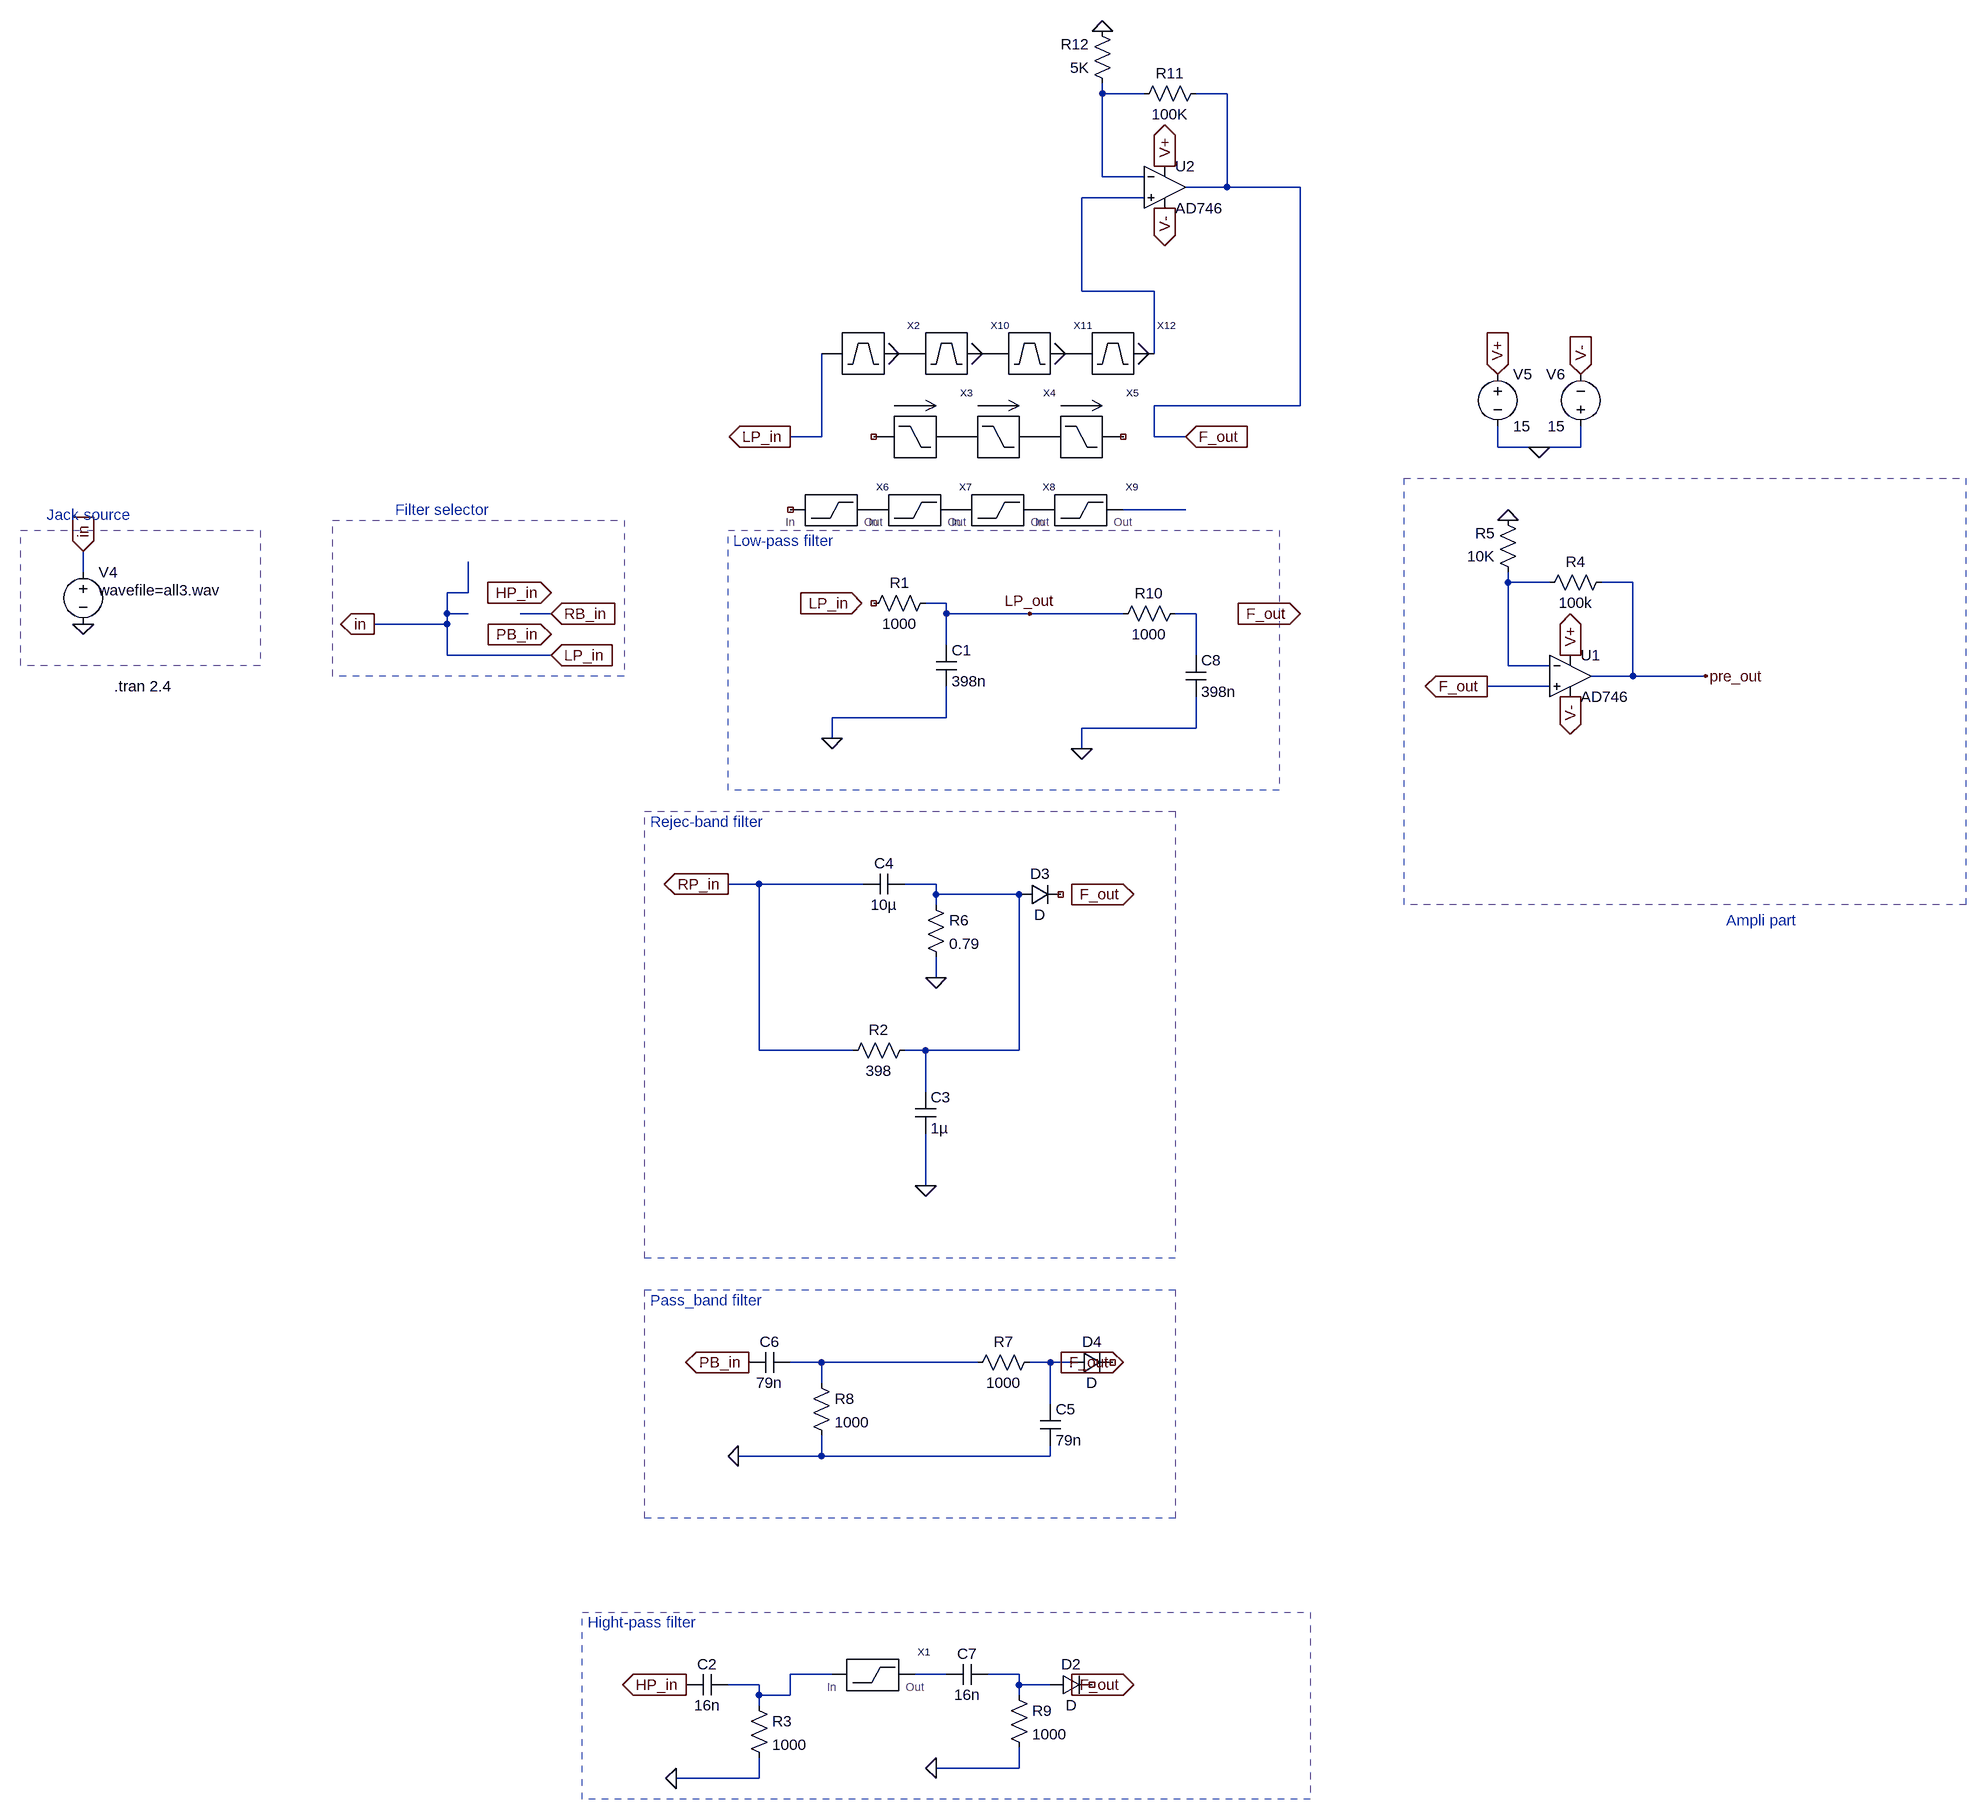
[diagram p0: schematic Filter_LT.asc]
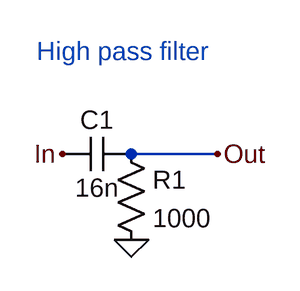
[diagram p1: sub-circuit hpassfilter.asc]
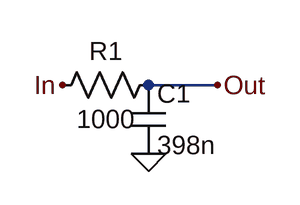
[diagram p2: sub-circuit lpassfilter.asc]
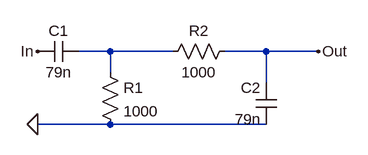
[diagram p3: sub-circuit bpassfilter.asc]
Filter_LT.asc, the LTspice schematic file:
Version 4
SHEET 1 2640 1908
WIRE 464 -720 464 -736
WIRE 528 -720 464 -720
WIRE 656 -720 608 -720
WIRE 464 -592 464 -720
WIRE 528 -592 464 -592
WIRE 656 -576 656 -720
WIRE 656 -576 592 -576
WIRE 768 -576 656 -576
WIRE 528 -560 432 -560
WIRE 432 -416 432 -560
WIRE 544 -416 432 -416
WIRE 544 -320 544 -416
WIRE 768 -240 768 -576
WIRE 768 -240 544 -240
WIRE 32 -192 32 -320
WIRE 32 -192 -16 -192
WIRE 544 -192 544 -240
WIRE 592 -192 544 -192
WIRE 1072 -176 1072 -208
WIRE 1136 -176 1072 -176
WIRE 1200 -176 1200 -208
WIRE 1200 -176 1136 -176
WIRE 592 -80 496 -80
WIRE -1104 16 -1104 -16
WIRE 1088 32 1088 16
WIRE 1152 32 1088 32
WIRE 1280 32 1232 32
WIRE -512 48 -512 0
WIRE -512 48 -544 48
WIRE 224 64 192 64
WIRE -544 80 -544 48
WIRE -512 80 -544 80
WIRE -384 80 -432 80
WIRE 224 80 224 64
WIRE 352 80 224 80
WIRE 496 80 352 80
WIRE 608 80 576 80
WIRE -544 96 -544 80
WIRE -544 96 -656 96
WIRE 224 128 224 80
WIRE -544 144 -544 96
WIRE -384 144 -544 144
WIRE 608 144 608 80
WIRE 1088 160 1088 32
WIRE 1152 160 1088 160
WIRE 1280 176 1280 32
WIRE 1280 176 1216 176
WIRE 1392 176 1280 176
WIRE 1152 192 1056 192
WIRE 224 240 224 192
WIRE 224 240 48 240
WIRE 608 256 608 208
WIRE 608 256 432 256
WIRE 48 272 48 240
WIRE 432 288 432 256
WIRE -64 496 -112 496
WIRE 96 496 -64 496
WIRE 208 496 160 496
WIRE 208 512 208 496
WIRE 336 512 208 512
WIRE 208 528 208 512
WIRE 208 640 208 608
WIRE -64 752 -64 496
WIRE 80 752 -64 752
WIRE 192 752 160 752
WIRE 336 752 336 512
WIRE 336 752 192 752
WIRE 192 816 192 752
WIRE 192 960 192 880
WIRE 32 1232 -16 1232
WIRE 272 1232 32 1232
WIRE 384 1232 352 1232
WIRE 416 1232 384 1232
WIRE 32 1264 32 1232
WIRE 384 1296 384 1232
WIRE 32 1376 32 1344
WIRE 32 1376 -96 1376
WIRE 384 1376 384 1360
WIRE 384 1376 32 1376
WIRE 48 1712 -16 1712
WIRE 224 1712 176 1712
WIRE 336 1712 288 1712
WIRE -64 1728 -112 1728
WIRE 336 1728 336 1712
WIRE 384 1728 336 1728
WIRE -64 1744 -64 1728
WIRE -16 1744 -16 1712
WIRE -16 1744 -64 1744
WIRE 336 1744 336 1728
WIRE -64 1760 -64 1744
WIRE 336 1856 336 1824
WIRE 336 1856 208 1856
WIRE -64 1872 -64 1840
WIRE -64 1872 -192 1872
FLAG 48 272 0
FLAG -1104 -16 in
IOPIN -1104 -16 In
FLAG 0 64 LP_in
IOPIN 0 64 Out
FLAG -1104 96 0
FLAG -176 1728 HP_in
IOPIN -176 1728 Out
FLAG -192 1872 0
FLAG 1184 144 V+
IOPIN 1184 144 Out
FLAG 1184 208 V-
IOPIN 1184 208 Out
FLAG 1072 -288 V+
IOPIN 1072 -288 In
FLAG 1200 -288 V-
IOPIN 1200 -288 In
FLAG 1136 -176 0
FLAG 512 1728 F_out
IOPIN 512 1728 In
FLAG 1088 -64 0
FLAG 1056 192 F_out
IOPIN 1056 192 Out
FLAG -656 96 in
IOPIN -656 96 Out
FLAG -384 48 HP_in
IOPIN -384 48 In
FLAG -384 144 LP_in
IOPIN -384 144 In
FLAG 192 960 0
FLAG -112 496 RP_in
IOPIN -112 496 Out
FLAG 208 640 0
FLAG 512 512 F_out
IOPIN 512 512 In
FLAG -384 80 RB_in
IOPIN -384 80 In
FLAG -384 112 PB_in
IOPIN -384 112 In
FLAG -80 1232 PB_in
IOPIN -80 1232 Out
FLAG -96 1376 0
FLAG 496 1232 F_out
IOPIN 496 1232 In
FLAG 352 80 LP_out
FLAG 768 80 F_out
IOPIN 768 80 In
FLAG 208 1856 0
FLAG 432 288 0
FLAG -16 -192 LP_in
IOPIN -16 -192 Out
FLAG 592 -192 F_out
IOPIN 592 -192 In
FLAG 1392 176 pre_out
FLAG 560 -608 V+
IOPIN 560 -608 Out
FLAG 560 -544 V-
IOPIN 560 -544 Out
FLAG 464 -816 0
SYMBOL cap 208 128 R0
SYMATTR InstName C1
SYMATTR Value 398n
SYMBOL res 208 48 R90
WINDOW 0 0 56 VBottom 2
WINDOW 3 32 56 VTop 2
SYMATTR InstName R1
SYMATTR Value 1000
SYMBOL voltage -1104 0 R0
WINDOW 3 24 44 Left 2
SYMATTR Value wavefile=all3.wav
SYMATTR InstName V4
SYMBOL cap -176 1744 R270
WINDOW 0 32 32 VTop 2
WINDOW 3 0 32 VBottom 2
SYMATTR InstName C2
SYMATTR Value 16n
SYMBOL res -80 1744 R0
SYMATTR InstName R3
SYMATTR Value 1000
SYMBOL OpAmps\\AD746 1184 112 R0
SYMATTR InstName U1
SYMBOL voltage 1072 -304 R0
WINDOW 123 0 0 Left 0
WINDOW 39 0 0 Left 0
SYMATTR InstName V5
SYMATTR Value 15
SYMBOL voltage 1200 -192 R180
WINDOW 0 24 96 Left 2
WINDOW 3 24 16 Left 2
WINDOW 123 0 0 Left 0
WINDOW 39 0 0 Left 0
SYMATTR InstName V6
SYMATTR Value 15
SYMBOL res 1248 16 R90
WINDOW 0 0 56 VBottom 2
WINDOW 3 32 56 VTop 2
SYMATTR InstName R4
SYMATTR Value 100k
SYMBOL res 1104 32 R180
WINDOW 0 36 76 Left 2
WINDOW 3 36 40 Left 2
SYMATTR InstName R5
SYMATTR Value 10K
SYMBOL cap 176 816 R0
SYMATTR InstName C3
SYMATTR Value 1µ
SYMBOL res 176 736 R90
WINDOW 0 0 56 VBottom 2
WINDOW 3 32 56 VTop 2
SYMATTR InstName R2
SYMATTR Value 398
SYMBOL cap 96 512 R270
WINDOW 0 32 32 VTop 2
WINDOW 3 0 32 VBottom 2
SYMATTR InstName C4
SYMATTR Value 10µ
SYMBOL res 192 512 R0
SYMATTR InstName R6
SYMATTR Value 0.79
SYMBOL cap 368 1296 R0
SYMATTR InstName C5
SYMATTR Value 79n
SYMBOL res 368 1216 R90
WINDOW 0 0 56 VBottom 2
WINDOW 3 32 56 VTop 2
SYMATTR InstName R7
SYMATTR Value 1000
SYMBOL cap -80 1248 R270
WINDOW 0 32 32 VTop 2
WINDOW 3 0 32 VBottom 2
SYMATTR InstName C6
SYMATTR Value 79n
SYMBOL res 16 1248 R0
SYMATTR InstName R8
SYMATTR Value 1000
SYMBOL diode 336 528 R270
WINDOW 0 32 32 VTop 2
WINDOW 3 0 32 VBottom 2
SYMATTR InstName D3
SYMBOL diode 416 1248 R270
WINDOW 0 32 32 VTop 2
WINDOW 3 0 32 VBottom 2
SYMATTR InstName D4
SYMBOL cap 224 1728 R270
WINDOW 0 32 32 VTop 2
WINDOW 3 0 32 VBottom 2
SYMATTR InstName C7
SYMATTR Value 16n
SYMBOL res 320 1728 R0
SYMATTR InstName R9
SYMATTR Value 1000
SYMBOL diode 384 1744 R270
WINDOW 0 32 32 VTop 2
WINDOW 3 0 32 VBottom 2
SYMATTR InstName D2
SYMBOL cap 592 144 R0
SYMATTR InstName C8
SYMATTR Value 398n
SYMBOL res 592 64 R90
WINDOW 0 0 56 VBottom 2
WINDOW 3 32 56 VTop 2
SYMATTR InstName R10
SYMATTR Value 1000
SYMBOL hpassFilter 112 1712 R0
SYMATTR InstName X1
SYMBOL LpassFilter 176 -192 R0
SYMATTR InstName X3
SYMBOL LpassFilter 304 -192 R0
SYMATTR InstName X4
SYMBOL LpassFilter 432 -192 R0
SYMATTR InstName X5
SYMBOL hpassFilter 48 -80 R0
SYMATTR InstName X6
SYMBOL hpassFilter 176 -80 R0
SYMATTR InstName X7
SYMBOL hpassFilter 304 -80 R0
SYMATTR InstName X8
SYMBOL hpassFilter 432 -80 R0
SYMATTR InstName X9
SYMBOL BpassFilter 96 -320 R0
SYMATTR InstName X2
SYMBOL BpassFilter 224 -320 R0
SYMATTR InstName X10
SYMBOL OpAmps\\AD746 560 -640 R0
SYMATTR InstName U2
SYMBOL res 624 -736 R90
WINDOW 0 0 56 VBottom 2
WINDOW 3 32 56 VTop 2
SYMATTR InstName R11
SYMATTR Value 100K
SYMBOL res 480 -720 R180
WINDOW 0 36 76 Left 2
WINDOW 3 36 40 Left 2
SYMATTR InstName R12
SYMATTR Value 5K
SYMBOL BpassFilter 352 -320 R0
SYMATTR InstName X11
SYMBOL BpassFilter 480 -320 R0
SYMATTR InstName X12
TEXT -1056 192 Left 2 !.tran 2.4
TEXT -104 -32 Left 2 ;Low-pass filter
TEXT -1160 -72 Left 2 ;Jack source
TEXT 1424 552 Left 2 ;Ampli part
TEXT -328 1632 Left 2 ;Hight-pass filter
TEXT -232 400 Left 2 ;Rejec-band filter
TEXT -624 -80 Left 2 ;Filter selector
TEXT -232 1136 Left 2 ;Pass_band filter
RECTANGLE Normal 736 352 -112 -48 2
RECTANGLE Normal -832 160 -1200 -48 2
RECTANGLE Normal 784 1904 -336 1616 2
RECTANGLE Normal -272 176 -720 -64 2
RECTANGLE Normal 576 1072 -240 384 2
RECTANGLE Normal 1792 528 928 -128 2
RECTANGLE Normal 576 1472 -240 1120 2

hpassfilter.asc, the sub-circuit schematic file:
Version 4
SHEET 1 880 680
WIRE 240 144 160 144
FLAG 160 224 0
FLAG 96 144 In
FLAG 240 144 Out
SYMBOL cap 160 128 R90
WINDOW 0 0 32 VBottom 2
WINDOW 3 32 32 VTop 2
SYMATTR InstName C1
SYMATTR Value 16n
SYMBOL res 144 128 R0
SYMATTR InstName R1
SYMATTR Value 1000
TEXT 72 48 Left 2 ;High pass filter

lpassfilter.asc, the sub-circuit schematic file:
Version 4
SHEET 1 880 680
WIRE 208 112 144 112
FLAG 144 176 0
FLAG 64 112 In
FLAG 208 112 Out
SYMBOL res 160 96 R90
WINDOW 0 0 56 VBottom 2
WINDOW 3 32 56 VTop 2
SYMATTR InstName R1
SYMATTR Value 1000
SYMBOL cap 128 112 R0
SYMATTR InstName C1
SYMATTR Value 398n

bpassfilter.asc, the sub-circuit schematic file:
Version 4
SHEET 1 880 680
WIRE -128 96 -176 96
WIRE -32 96 -128 96
WIRE 112 96 48 96
WIRE 192 96 112 96
WIRE -128 128 -128 96
WIRE 112 144 112 96
WIRE -128 208 -240 208
WIRE 112 208 -128 208
FLAG -240 208 0
FLAG -240 96 In
FLAG 192 96 Out
SYMBOL cap -176 80 R90
WINDOW 0 0 32 VBottom 2
WINDOW 3 32 32 VTop 2
SYMATTR InstName C1
SYMATTR Value 79n
SYMBOL cap 128 208 R180
WINDOW 0 24 56 Left 2
WINDOW 3 24 8 Left 2
SYMATTR InstName C2
SYMATTR Value 79n
SYMBOL res -144 112 R0
SYMATTR InstName R1
SYMATTR Value 1000
SYMBOL res 64 80 R90
WINDOW 0 0 56 VBottom 2
WINDOW 3 32 56 VTop 2
SYMATTR InstName R2
SYMATTR Value 1000

The netlist it stands for:
* Filter_LT.asc
C1 LP_out 0 398n
R1 LP_out NC_01 1000
V4 LP_in 0 wavefile=all3.wav
C2 HP_in N009 16n
R3 N009 0 1000
XU1 F_out N004 V+ V- pre_out AD746  ; pins In+ In- V+ V- OUT
V5 V+ 0 15
V6 0 V- 15
R4 pre_out N004 100k
R5 N004 0 10K
C3 N006 0 1µ
R2 N006 RP_in 398
C4 RP_in N006 10µ
R6 N006 0 0.79
C5 N008 0 79n
R7 N008 N007 1000
C6 PB_in N007 79n
R8 N007 0 1000
D3 N006 NC_02 D
D4 N008 NC_03 D
C7 N010 N011 16n
R9 N011 0 1000
D2 N011 NC_04 D
C8 N005 0 398n
R10 N005 LP_out 1000
XX1 N009 N010 hpassfilter
XX3 NC_05 P001 lpassfilter
XX4 P001 P002 lpassfilter
XX5 P002 NC_06 lpassfilter
XX6 NC_07 P003 hpassfilter
XX7 P003 P004 hpassfilter
XX8 P004 P005 hpassfilter
XX9 P005 N003 hpassfilter
XX2 LP_in P006 bpassfilter
XX10 P006 P007 bpassfilter
XU2 N002 N001 V+ V- F_out AD746  ; pins In+ In- V+ V- OUT
R11 F_out N001 100K
R12 N001 0 5K
XX11 P007 P008 bpassfilter
XX12 P008 N002 bpassfilter

* block symbol definitions
.subckt hpassfilter In Out
C1 Out In 16n
R1 Out 0 1000
* High pass filter
.ends hpassfilter

.subckt lpassfilter In Out
R1 Out In 1000
C1 Out 0 398n
.ends lpassfilter

.subckt bpassfilter In Out
C1 N001 In 79n
C2 0 Out 79n
R1 N001 0 1000
R2 Out N001 1000
.ends bpassfilter

.model D D
.lib standard.dio
.tran 2.4
* Low-pass filter
* Jack source
* Ampli part
* Hight-pass filter
* Rejec-band filter
* Filter selector
* Pass_band filter
.backanno
.end